# Altium schematic sheet TopSheet.SchDoc
size A4; CompanyName: Technische Hochschule Nürnberg Georg Simon Ohm; Organization: UltraZohm; Address1: Kesslerplatz 12; Address2: 90489 Nürnberg; Address3: GERMANY; Website: www.ultrazohm.com
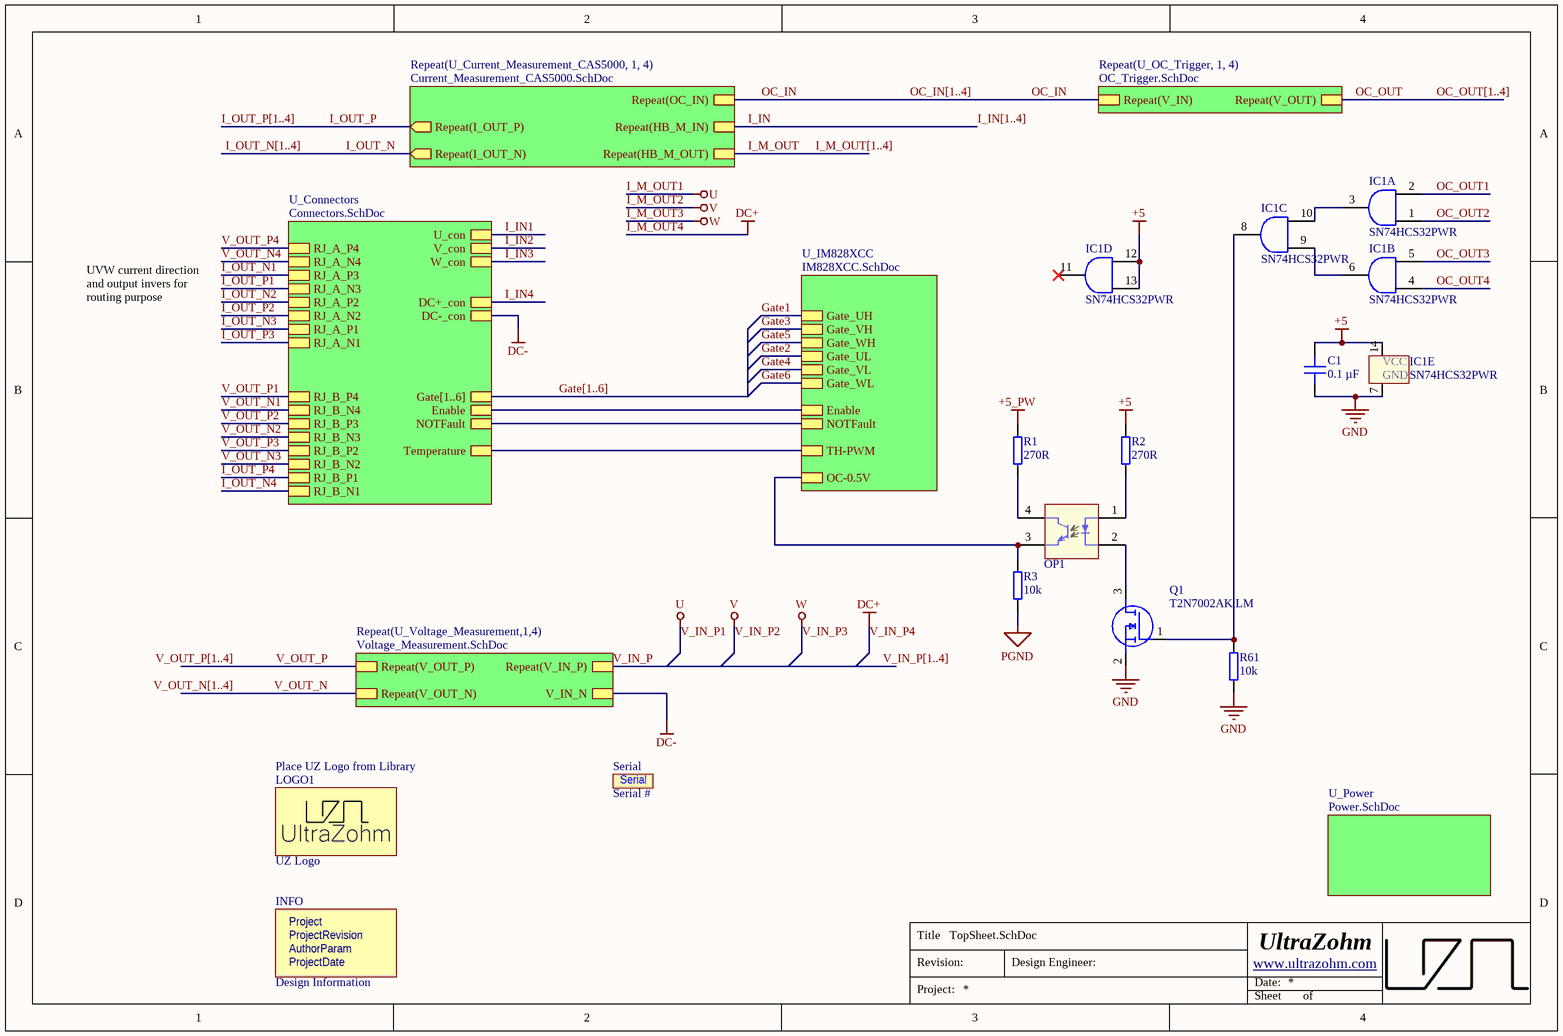
[diagram p0: TopSheet.SchDoc]

## Parts
C1  0.1 µF  [C_0603]
IC1  SN74HCS32PWR  [TSSOP-14]  (parts A,B,C,D,E of 5)
INFO  Design Information  [Design_info]  (no BOM)
LOGO1  UZ Logo  [UZ_Logo_small]  (no BOM)
OP1  VO617A-2X017T  [SMD4]  (value not drawn)
Q1  T2N7002AK,LM  [SOT-23-3]
R1  270R  [RES 0603_1608]
R2  270R  [RES 0603_1608]
R3  10k  [RES 0603_1608]
R61  10k  [RES 0603_1608]
Serial  Serial #  [SERIAL]  (no BOM)

## Sub-sheets
Repeat(U_Current_Measurement_CAS5000, 1, 4) = Current_Measurement_CAS5000.SchDoc: Repeat(HB_M_IN), Repeat(HB_M_OUT), Repeat(I_OUT_P) (out), Repeat(I_OUT_N) (out), Repeat(OC_IN)
Repeat(U_OC_Trigger, 1, 4) = OC_Trigger.SchDoc: Repeat(V_IN), Repeat(V_OUT)
Repeat(U_Voltage_Measurement,1,4) = Voltage_Measurement.SchDoc: Repeat(V_IN_P), V_IN_N, Repeat(V_OUT_N), Repeat(V_OUT_P)
U_Connectors = Connectors.SchDoc: Gate[1..6], Enable, Temperature, NOTFault, RJ_A_P4, RJ_A_N4, RJ_A_P3, RJ_A_N3, RJ_A_P2, RJ_A_N2, RJ_A_P1, RJ_A_N1, RJ_B_P4, RJ_B_N4, RJ_B_P3, RJ_B_N3, RJ_B_P2, RJ_B_N2, RJ_B_P1, RJ_B_N1, DC+_con, DC-_con, U_con, V_con, W_con
U_IM828XCC = IM828XCC.SchDoc: Gate_UL, Gate_VL, Gate_WL, Gate_WH, Gate_VH, Gate_UH, OC-0.5V, Enable, NOTFault, TH-PWM
U_Power = Power.SchDoc: no entries

## Nets
+5: C1.2 IC1.12 IC1.13 IC1.14 R2.2
+5_PW: R1.2
DC-: sheet U_Connectors/DC-_con, sheet Repeat(U_Voltage_Measurement,1,4)/V_IN_N
GND: C1.1 IC1.7 Q1.2(S) R61.1
PGND: R3.1
Gate1: sheet U_IM828XCC/Gate_UH
Gate2: sheet U_IM828XCC/Gate_UL
Gate3: sheet U_IM828XCC/Gate_VH
Gate4: sheet U_IM828XCC/Gate_VL
Gate5: sheet U_IM828XCC/Gate_WH
Gate6: sheet U_IM828XCC/Gate_WL
I_IN: sheet Repeat(U_Current_Measurement_CAS5000, 1, 4)/Repeat(HB_M_IN)
I_IN1: sheet U_Connectors/U_con
I_IN2: sheet U_Connectors/V_con
I_IN3: sheet U_Connectors/W_con
I_IN4: sheet U_Connectors/DC+_con
I_M_OUT: sheet Repeat(U_Current_Measurement_CAS5000, 1, 4)/Repeat(HB_M_OUT)
I_OUT_N: sheet Repeat(U_Current_Measurement_CAS5000, 1, 4)/Repeat(I_OUT_N)
I_OUT_N1: sheet U_Connectors/RJ_A_P3
I_OUT_N2: sheet U_Connectors/RJ_A_P2
I_OUT_N3: sheet U_Connectors/RJ_A_P1
I_OUT_N4: sheet U_Connectors/RJ_B_N1
I_OUT_P: sheet Repeat(U_Current_Measurement_CAS5000, 1, 4)/Repeat(I_OUT_P)
I_OUT_P1: sheet U_Connectors/RJ_A_N3
I_OUT_P2: sheet U_Connectors/RJ_A_N2
I_OUT_P3: sheet U_Connectors/RJ_A_N1
I_OUT_P4: sheet U_Connectors/RJ_B_P1
OC_IN: sheet Repeat(U_Current_Measurement_CAS5000, 1, 4)/Repeat(OC_IN), sheet Repeat(U_OC_Trigger, 1, 4)/Repeat(V_IN)
OC_OUT: sheet Repeat(U_OC_Trigger, 1, 4)/Repeat(V_OUT)
OC_OUT1: IC1.2
OC_OUT2: IC1.1
OC_OUT3: IC1.5
OC_OUT4: IC1.4
V_IN_P: sheet Repeat(U_Voltage_Measurement,1,4)/Repeat(V_IN_P)
V_OUT_N: sheet Repeat(U_Voltage_Measurement,1,4)/Repeat(V_OUT_N)
V_OUT_N1: sheet U_Connectors/RJ_B_N4
V_OUT_N2: sheet U_Connectors/RJ_B_N3
V_OUT_N3: sheet U_Connectors/RJ_B_N2
V_OUT_N4: sheet U_Connectors/RJ_A_N4
V_OUT_P: sheet Repeat(U_Voltage_Measurement,1,4)/Repeat(V_OUT_P)
V_OUT_P1: sheet U_Connectors/RJ_B_P4
V_OUT_P2: sheet U_Connectors/RJ_B_P3
V_OUT_P3: sheet U_Connectors/RJ_B_P2
V_OUT_P4: sheet U_Connectors/RJ_A_P4
NetIC1_3: IC1.3 IC1.10
NetIC1_6: IC1.6 IC1.9
NetIC1_8: IC1.8 Q1.1(G) R61.2
NetOP1_1: OP1.1 R2.1
NetOP1_2: OP1.2 Q1.3(D)
NetOP1_3: OP1.3 R3.2 ; sheet U_IM828XCC/OC-0.5V
NetOP1_4: OP1.4 R1.1
(unnamed): sheet U_IM828XCC/Enable, sheet U_Connectors/Enable
(unnamed): sheet U_IM828XCC/NOTFault, sheet U_Connectors/NOTFault
(unnamed): sheet U_IM828XCC/TH-PWM, sheet U_Connectors/Temperature

Not connected (* = marked no-connect by the designer): IC1 11*

## Buses and harness runs
bus Gate[1..6] = sheet U_Connectors/Gate[1..6]
bus I_IN[1..4]
bus I_M_OUT[1..4]
bus I_OUT_N[1..4]
bus I_OUT_P[1..4]
bus OC_IN[1..4]
bus OC_OUT[1..4]
bus V_IN_P[1..4]
bus V_OUT_N[1..4]
bus V_OUT_P[1..4]

## Notes on the sheet
- UVW current direction and output invers for routing purpose
- (near LOGO1) Place UZ Logo from Library
- Title
- Revision:
- Design Engineer:
- Date:
- Project:
- Sheet
- of
- (in symbol Design Information) Project; ProjectRevision; AuthorParam; ProjectDate
- (in symbol SN74HCS32PWR, part E) VCC; GND

## Library data of the parts
C1 = C0603X104K5RAC7411: Capacitor 0603, 50 VDC, 0.1 µF, X7R; Manufacturer: KEMET; Tolerance: 10 %; Voltage Rating: 50 VDC; Created from: MGremer; Manufacturer Part Number: C0603X104K5RAC7411; PartID: 3; Created On: 20.12.2020 13:54:13; ComponentLink1Description: Datasheet; ComponentLink1URL: https://www.mouser.de/datasheet/2/212/1/KEM_C1013_X7R_FT_CAP_SMD-1103280.pdf; Component Type: Capacitor 0603; Device Package: 0603; Last Updated: 04.03.2021 09:24:28; Mounting Type: SMD; Operating Temperature: -55 - 125°C; Series: SMD Comm X7R Flex; Supplier 1: Mouser; Supplier Part Number 1: 80-C0603X104K5R7411; Supplier 2: LCSC; Supplier Part Number 2: C14663; Type: Capacitor; Value: 0.1 µF; Live Cycle Status: 1; LCSC Part Number: C14663; Stock number: Labor SMD Container
IC1 = SN74HCS32PWR: Logische Gatter Quadruple 2-input OR gates with Schmitt-trigger inputs 14-TSSOP -40 to 125; Manufacturer: Texas Instruments; Value: 6 V; Created from: VStarost; Manufacturer Part Number: SN74HCS32PWR; PartID: 5; Created On: 31.01.2023 11:53:14; ComponentLink1Description: Datasheet; ComponentLink1URL: https://www.ti.com/lit/ds/symlink/sn74hcs32.pdf?HQS=dis-mous-null-mousermode-dsf-pf-null-wwe&ts=1675161071566&ref_url=https%253A%252F%252Fwww.mouser.de%252F; Component Type: OR; Device Package: TSSOP-14; Last Updated: 31.01.2023 11:53:14; Mounting Type: SMD; Operating Temperature: -40 - 125 °C; Series: SN74HCS32; Supplier 1: Mouser; Supplier Part Number 1: 595-SN74HCS32PWR; Type: OR; Live Cycle Status: 1; Stock number: not stored
INFO = Design Information: Manufacturer: UltraZohm; Created from: MGremer; Manufacturer Part Number: Design Information; PartID: 12; Created On: 03.11.2021 09:04:23; ComponentLink1Description: https://docs.ultrazohm.com/; ComponentLink1URL: homepage; Component Type: Design Information; Last Updated: 03.11.2021 09:28:34; Supplier 1: -; Supplier Part Number 1: -; Type: Design Information; Value: Design Information; Live Cycle Status: 1
LOGO1 = Logo small: Manufacturer: UltraZohm; Created from: MGremer; Created: Jan2021_Liegmann; Value: Logo; Manufacturer Part Number: Logo small; PartID: 10; Created On: 03.11.2021 09:04:23; ComponentLink1Description: https://docs.ultrazohm.com/; ComponentLink1URL: homepage; Component Type: Logo; Last Updated: 03.11.2021 09:05:50; Supplier 1: -; Supplier Part Number 1: -; Type: Logo; Live Cycle Status: 1
OP1 = VO617A-2X017T: Transistor-Ausgangsoptokoppler H. Relblty 5300 Vrms 63-125% CTR, VDE; Manufacturer: Vishay; Channels: 1; Created from: VStarost; Manufacturer Part Number: VO617A-2X017T; PartID: 4; Created On: 31.01.2023 09:27:11; ComponentLink1Description: Datasheet; ComponentLink1URL: https://www.mouser.de/datasheet/2/427/vo617a-1766974.pdf; Component Type: Optokoppler; Last Updated: 31.01.2023 09:27:11; Mounting Type: SMD; Operating Temperature: -55 - +110 °C; Supplier 1: Mouser; Supplier Part Number 1: 78-VO617A-2X017T; Type: Optokoppler; Live Cycle Status: 1
Q1 = T2N7002AK,LM: Small-signal MOSFET, n-Channel, 200 mA, 60 V; Manufacturer: Toshiba; Type: Power MOSFET; Value: 60 V; Created from: VStarost; Manufacturer Part Number: T2N7002AK,LM; PartID: 4; Created On: 24.01.2023 08:00:45; ComponentLink1Description: Datasheet; ComponentLink1URL: https://toshiba.semicon-storage.com/info/T2N7002AK_datasheet_en_20150401.pdf?did=29712&prodName=T2N7002AK; Component Type: Small-signal MOSFET; Device Package: SOT-23-3; Last Updated: 15.02.2023 18:16:19; Mounting Type: SMD; Operating Temperature: -55 - 150 °C; Series: T2N7002; Supplier 1: Mouser; Supplier Part Number 1: 757-T2N7002AKLM; Supplier 2: Digi-Key; Supplier Part Number 2: T2N7002AKLMCT-ND; Live Cycle Status: 1; Stock number: not stored; LCSC Part Number: C516175
R1 R2 = RK73B1JTTDD271J: SMD resistor E24 series; Manufacturer: KOA Speer; Tolerance: 5%; Created from: MGremer; Manufacturer Part Number: RK73B1JTTDD271J; PartID: 60; Created On: 14.12.2020 16:17:14; ComponentLink1Description: Datasheet; ComponentLink1URL: https://www.mouser.de/datasheet/2/219/RK73B-1825463.pdf; Component Type: SMD resistor; Device Package: 0603; Last Updated: 15.02.2023 17:43:45; Mounting Type: SMD; Supplier 1: Mouser; Supplier Part Number 1: 660-RK73B1JTTDD271J; Type: Resistor; Value: 270R; Live Cycle Status: 1; Stock number: Labor SMD Container; LCSC Part Number: C177305
R3 R61 = MCWR06X1002FTL: SMD resistor 1%; Manufacturer: Multicomp PRO; Created from: MGremer; Manufacturer Part Number: MCWR06X1002FTL; PartID: 176; Created On: 14.12.2020 16:17:14; ComponentLink1Description: Datasheet; ComponentLink1URL: http://www.farnell.com/datasheets/2860681.pdf; Component Type: SMD resistor; Device Package: 0603; Last Updated: 15.02.2023 17:53:17; Mounting Type: SMD; Supplier 1: Farnell; Supplier Part Number 1: 2447230; Type: Resistor; Tolerance: 1%; Value: 10k; Live Cycle Status: 1; Stock number: not stored; LCSC Part Number: C269701
Serial = SerialNumber: Empty serial number of the PCB. Can be used for manually writing the serial number